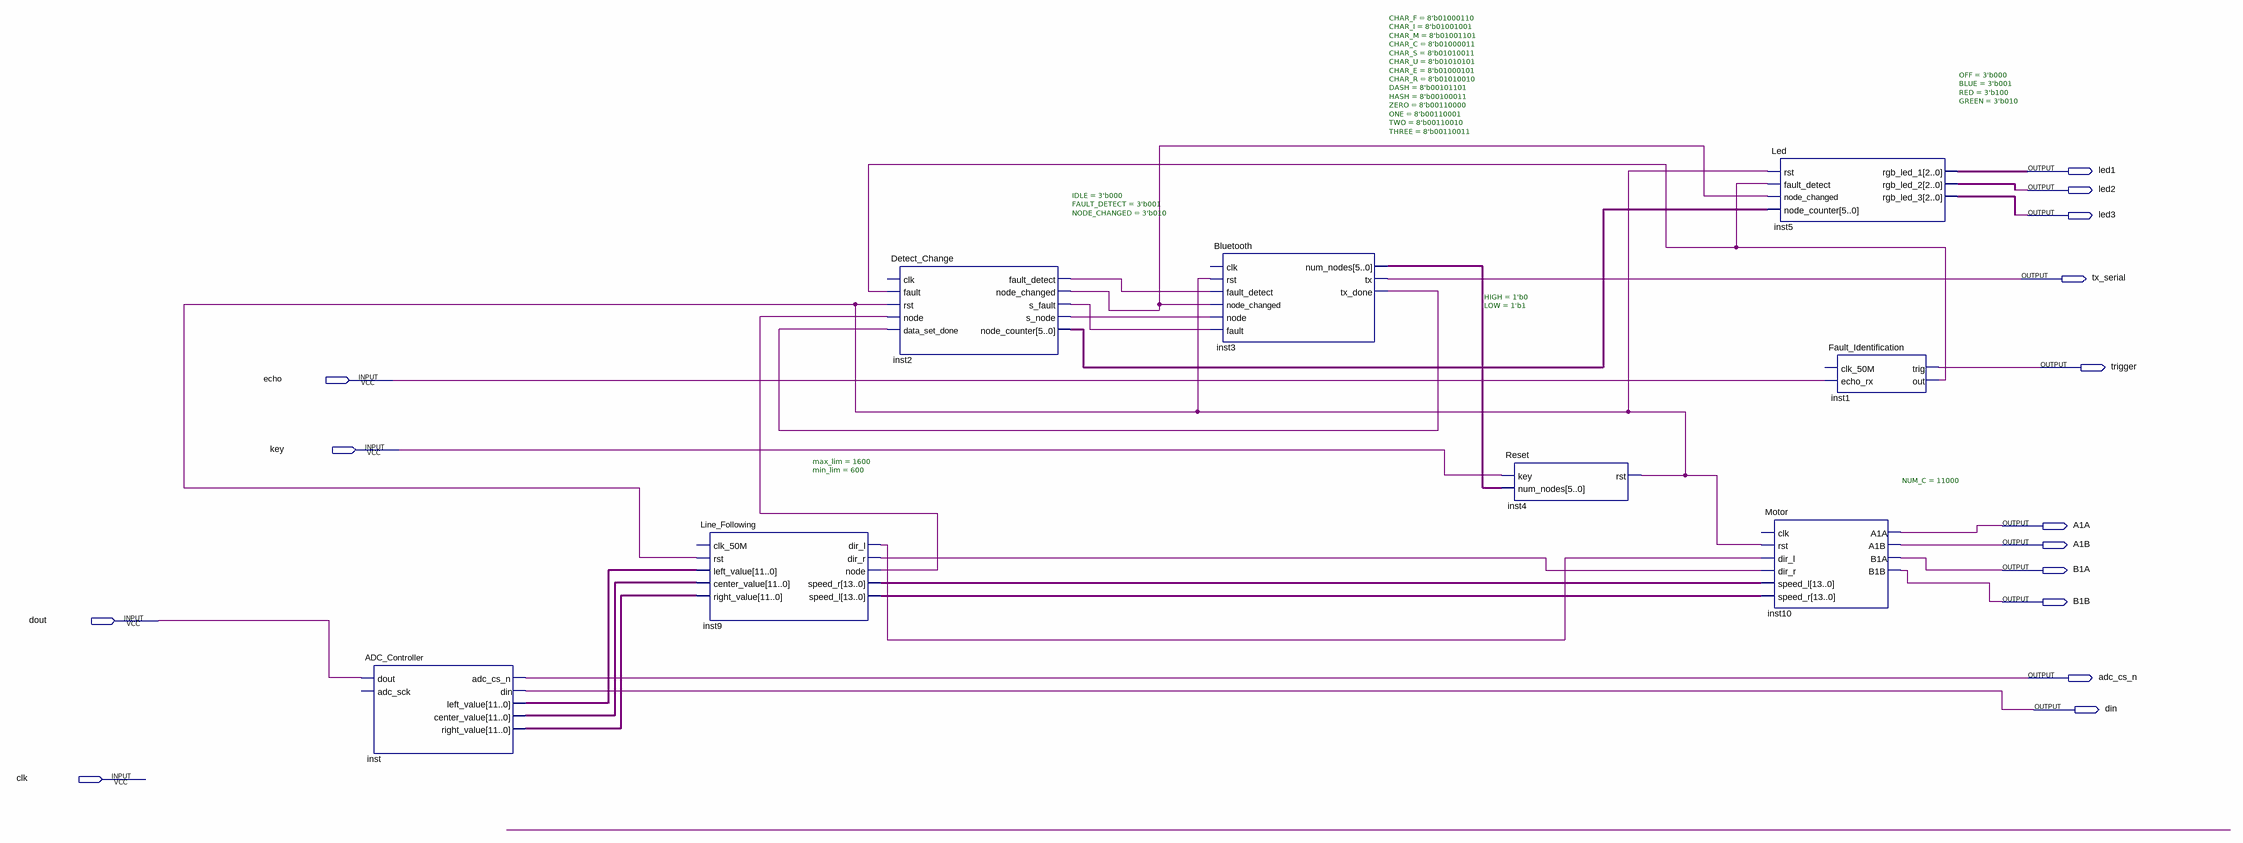
[diagram p0: schematic sheet]
// Quartus schematic AB_3162_Task4.bdf as structural Verilog: 8 symbols, 15 pins
module AB_3162_Task4 (
  input  echo,
  input  key,
  input  dout,
  input  clk,
  output led1,
  output led2,
  output led3,
  output tx_serial,
  output trigger,
  output A1A,
  output A1B,
  output B1A,
  output B1B,
  output adc_cs_n,
  output din
);

  wire inst1_out, inst2_fault_detect, inst2_node_changed, inst2_s_fault, inst2_s_node, inst3_tx_done,
       inst4_rst, inst9_dir_l, inst9_dir_r, inst9_node;
  wire [2:0] inst5_rgb_led_1, inst5_rgb_led_2, inst5_rgb_led_3;
  wire [5:0] inst2_node_counter, inst3_num_nodes;
  wire [11:0] inst_center_value, inst_left_value, inst_right_value;
  wire [13:0] inst9_speed_l, inst9_speed_r;

  ADC_Controller inst (
    .dout(dout), .adc_cs_n(adc_cs_n), .din(din), .left_value(inst_left_value),
    .center_value(inst_center_value), .right_value(inst_right_value));  // open: adc_sck
  Line_Following #(.max_lim(1600), .min_lim(600)) inst9 (
    .rst(inst4_rst), .left_value(inst_left_value), .center_value(inst_center_value),
    .right_value(inst_right_value), .dir_l(inst9_dir_l), .dir_r(inst9_dir_r), .node(inst9_node),
    .speed_r(inst9_speed_r), .speed_l(inst9_speed_l));  // open: clk_50M
  Detect_Change #(.IDLE(3'b000), .FAULT_DETECT(3'b001), .NODE_CHANGED(3'b010)) inst2 (
    .fault(inst1_out), .rst(inst4_rst), .node(inst9_node), .data_set_done(inst3_tx_done),
    .fault_detect(inst2_fault_detect), .node_changed(inst2_node_changed), .s_fault(inst2_s_fault),
    .s_node(inst2_s_node), .node_counter(inst2_node_counter));  // open: clk
  Bluetooth #(.CHAR_F(8'b01000110), .CHAR_I(8'b01001001), .CHAR_M(8'b01001101), .CHAR_C(8'b01000011), .CHAR_S(8'b01010011), .CHAR_U(8'b01010101), .CHAR_E(8'b01000101), .CHAR_R(8'b01010010), .DASH(8'b00101101), .HASH(8'b00100011), .ZERO(8'b00110000), .ONE(8'b00110001), .TWO(8'b00110010), .THREE(8'b00110011)) inst3 (
    .rst(inst4_rst), .fault_detect(inst2_fault_detect), .node_changed(inst2_node_changed),
    .node(inst2_s_node), .fault(inst2_s_fault), .num_nodes(inst3_num_nodes), .tx(tx_serial),
    .tx_done(inst3_tx_done));  // open: clk
  Reset #(.HIGH(1'b0), .LOW(1'b1)) inst4 (.key(key), .num_nodes(inst3_num_nodes), .rst(inst4_rst));
  Motor #(.NUM_C(11000)) inst10 (
    .rst(inst4_rst), .dir_l(inst9_dir_l), .dir_r(inst9_dir_r), .speed_l(inst9_speed_r),
    .speed_r(inst9_speed_l), .A1A(A1A), .A1B(A1B), .B1A(B1A), .B1B(B1B));  // open: clk
  Led #(.OFF(3'b000), .BLUE(3'b001), .RED(3'b100), .GREEN(3'b010)) inst5 (
    .rst(inst4_rst), .fault_detect(inst1_out), .node_changed(inst2_node_changed),
    .node_counter(inst2_node_counter), .rgb_led_1(inst5_rgb_led_1), .rgb_led_2(inst5_rgb_led_2),
    .rgb_led_3(inst5_rgb_led_3));
  Fault_Identification inst1 (.echo_rx(echo), .trig(trigger), .out(inst1_out));  // open: clk_50M
endmodule
